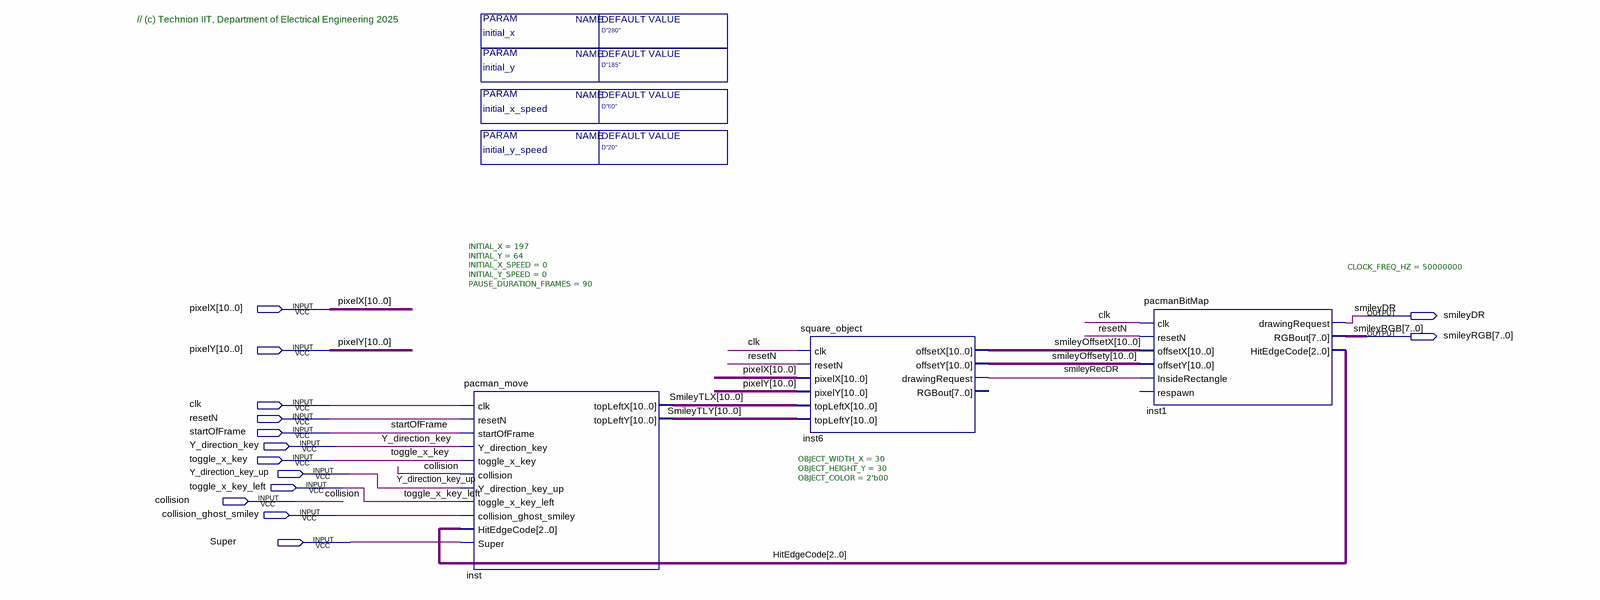
[diagram p0: schematic sheet]
// Quartus schematic Pacman_Block_T.bdf as structural Verilog: 3 symbols, 14 pins
module Pacman_Block_T #(parameter initial_x = "D\"280\"", parameter initial_y = "D\"185\"", parameter initial_x_speed = "D\"60\"", parameter initial_y_speed = "D\"20\"") (
  input  [10:0] pixelX,
  input  [10:0] pixelY,
  input  clk,
  input  resetN,
  input  startOfFrame,
  input  Y_direction_key,
  input  toggle_x_key,
  input  Y_direction_key_up,
  input  toggle_x_key_left,
  input  collision,
  input  collision_ghost_smiley,
  input  Super,
  output smileyDR,
  output [7:0] smileyRGB
);

  wire smileyRecDR;
  wire [2:0] HitEdgeCode;
  wire [10:0] smileyOffsetX, smileyOffsety, SmileyTLX, SmileyTLY;

  pacman_move #(.INITIAL_X(197), .INITIAL_Y(64), .INITIAL_X_SPEED(0), .INITIAL_Y_SPEED(0), .PAUSE_DURATION_FRAMES(90)) inst (
    .clk(clk), .resetN(resetN), .startOfFrame(startOfFrame), .Y_direction_key(Y_direction_key),
    .toggle_x_key(toggle_x_key), .collision(collision), .Y_direction_key_up(Y_direction_key_up),
    .toggle_x_key_left(toggle_x_key_left), .collision_ghost_smiley(collision_ghost_smiley),
    .HitEdgeCode(HitEdgeCode), .Super(Super), .topLeftX(SmileyTLX), .topLeftY(SmileyTLY));
  square_object #(.OBJECT_WIDTH_X(30), .OBJECT_HEIGHT_Y(30), .OBJECT_COLOR(2'b00)) inst6 (
    .clk(clk), .resetN(resetN), .pixelX(pixelX), .pixelY(pixelY), .topLeftX(SmileyTLX), .topLeftY(SmileyTLY),
    .offsetX(smileyOffsetX), .offsetY(smileyOffsety), .drawingRequest(smileyRecDR));  // open: RGBout
  pacmanBitMap #(.CLOCK_FREQ_HZ(50000000)) inst1 (
    .clk(clk), .resetN(resetN), .offsetX(smileyOffsetX), .offsetY(smileyOffsety),
    .InsideRectangle(smileyRecDR), .drawingRequest(smileyDR), .RGBout(smileyRGB), .HitEdgeCode(HitEdgeCode));  // open: respawn

  // Notes on the sheet:
  //   // (c) Technion IIT, Department of Electrical Engineering 2025
endmodule
